# Altium schematic sheet Sheet1.SchDoc
size A4
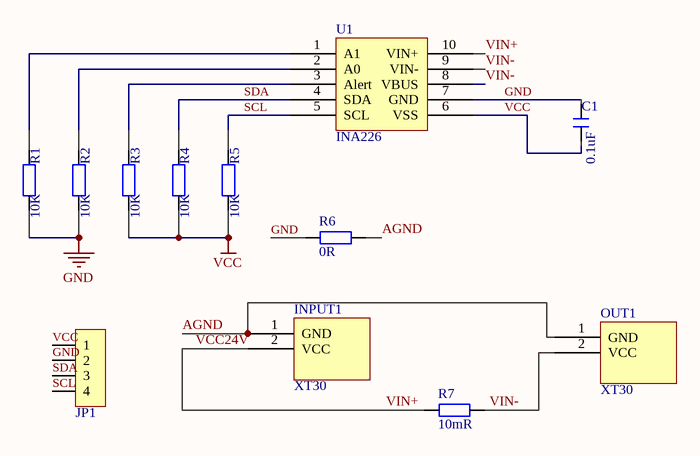
[diagram p0: Sheet1.SchDoc]

## Parts
C1  0.1uF  [C 0603_L]
INPUT1  XT30  [XT30]
JP1  HDR-1X4  [XH2.54-WI-4P]  (value not drawn)
OUT1  XT30  [XT30]
R1  10K  [R 0603_L]
R2  10K  [R 0603_L]
R3  10K  [R 0603_L]
R4  10K  [R 0603_L]
R5  10K  [R 0603_L]
R6  0R  [R 0805_L]
R7  10mR  [R 2512_L]
U1  INA226  [MSOP-10]

## Nets
GND: C1.2 JP1.2 R1.1 R2.1 R6.2 U1.7(GND)
VCC: C1.1 JP1.1 R3.1 R4.1 R5.1 U1.6(VSS)
AGND: INPUT1.1(GND) OUT1.1(GND) R6.1
SCL: JP1.4 R5.2 U1.5(SCL)
SDA: JP1.3 R4.2 U1.4(SDA)
VCC24V: INPUT1.2(VCC) R7.1 U1.10(VIN+)  [also labelled VIN+]
VIN-: OUT1.2(VCC) R7.2 U1.8(VBUS) U1.9(VIN-)
NetR1_2: R1.2 U1.1(A1)
NetR2_2: R2.2 U1.2(A0)
NetR3_2: R3.2 U1.3(Alert)

## Library data of the parts
C1 = C: 贴片电容; BOM名称: 无极性贴片电容; 淘宝ID: 封装库来自淘宝 ID：黄晶宝石; 联系售后: https://shop463601444.taobao.com
JP1 = Header 4: 4P接插件; 版权归属: 封装库来自淘宝 ID：黄晶宝石; BOM名称: 4P接插件; 学习资源: https://shop463601444.taobao.com
R1-R7 = R: 贴片电阻; 版权归属: 来自淘宝 ID：黄晶宝石; BOM名称: 贴片电阻; 联系售后: https://shop463601444.taobao.com